# Altium project distance_sensor.PrjPcb
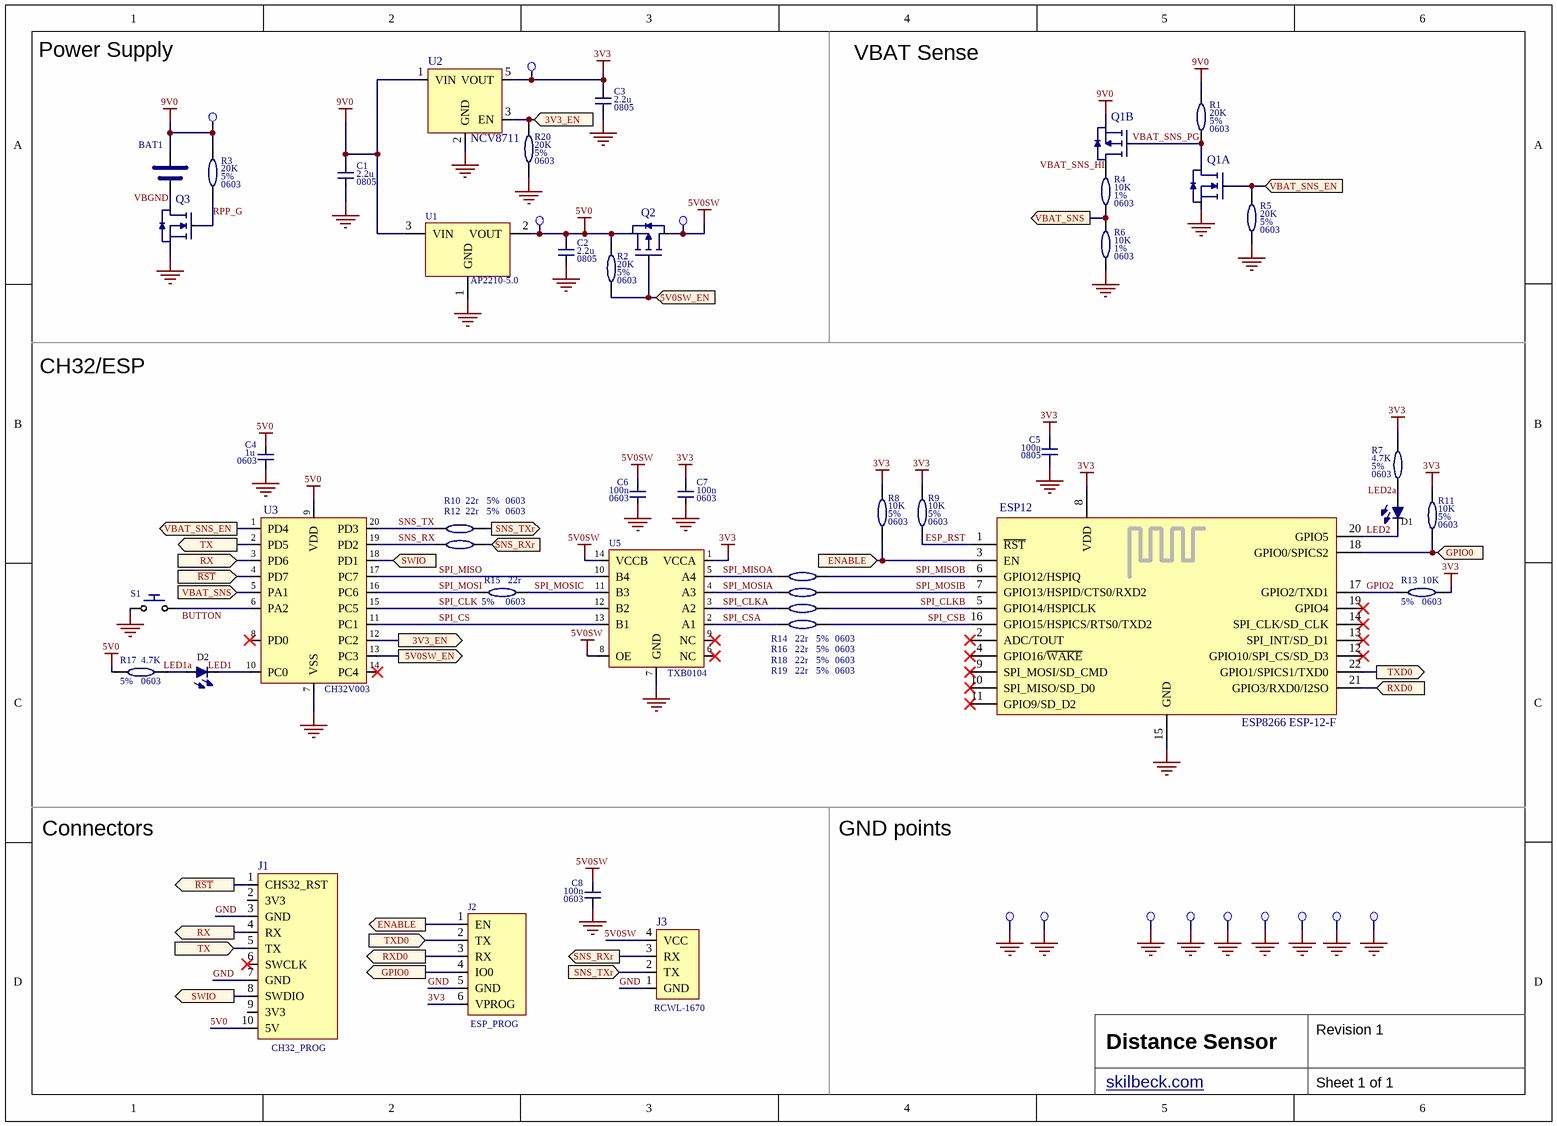
[diagram p0: distance_sensor.SchDoc]
1 sheet, 56 parts. Net scope: flat (ports and power ports of the same name join across sheets).
Board file: distance_sensor.PcbDoc

## Sheet distance_sensor.SchDoc: Distance Sensor
size 290 x 209 mm; Author: skilbeck.com; Revision: 1; SheetNumber: 1; SheetTotal: 1

### Parts
1  TESTPOINT  [TESTPOINT]  (value not drawn)  (no BOM)
2  TESTPOINT  [TESTPOINT]  (value not drawn)  (no BOM)
3  TESTPOINT  [TESTPOINT]  (value not drawn)  (no BOM)
4  TESTPOINT  [TESTPOINT]  (value not drawn)  (no BOM)
BAT1  BATTERY  [2X0.1HEADER]  (value not drawn)  (no BOM)
C1  2.2u  Package: 0805  [CAP 0805_2012]
C2  2.2u  Package: 0805  [CAP 0805_2012]
C3  2.2u  Package: 0805  [CAP 0805_2012]
C4  1u  Package: 0603  [CAP 0603_1608]
C5  100n  Package: 0805  [CAP 0805_2012]
C6  100n  Package: 0603  [CAP 0603_1608]
C7  100n  Package: 0603  [CAP 0603_1608]
C8  100n  Package: 0603  [CAP 0603_1608]
D1  *  [SMT_LED 0603_RED]  (value not drawn)
D2  *  [SMT_LED 0603_RED]  (value not drawn)
ESP12  ESP8266 ESP-12-F  [ESP8266 ESP-12-E]
GND1  TESTPOINT  [TESTPAD]  (value not drawn)  (no BOM)
GND2  TESTPOINT  [TESTPAD]  (value not drawn)  (no BOM)
GND5  TESTPOINT  [TESTPAD]  (value not drawn)  (no BOM)
GND6  TESTPOINT  [TESTPAD]  (value not drawn)  (no BOM)
GND7  TESTPOINT  [TESTPOINT]  (value not drawn)  (no BOM)
GND8  TESTPOINT  [TESTPAD]  (value not drawn)  (no BOM)
GND9  TESTPOINT  [TESTPAD]  (value not drawn)  (no BOM)
GND10  TESTPOINT  [TESTPAD]  (value not drawn)  (no BOM)
GND11  TESTPOINT  [TESTPAD]  (value not drawn)  (no BOM)
J1  CH32_PROG  [CH32_PROG]  (no BOM)
J2  ESP_PROG  [ESP_PROG]  (no BOM)
J3  RCWL-1670  [JST_PH_4WAY]
Q1  MOSFET-NP  [DMG6601LVT]  (value not drawn)  (parts A,B of 2)
Q2  MOSFET-P  [SOT95P230X110-3L]  (value not drawn)
Q3  MOSFET-N  [SOT95P230X110-3L]  (value not drawn)
R1  20K  Tolerance: 5%  Package: 0603  [RES 0603_1608]
R2  20K  Tolerance: 5%  Package: 0603  [RES 0603_1608]
R3  20K  Tolerance: 5%  Package: 0603  [RES 0603_1608]
R4  10K  Tolerance: 1%  Package: 0603  [RES 0603_1608]
R5  20K  Tolerance: 5%  Package: 0603  [RES 0603_1608]
R6  10K  Tolerance: 1%  Package: 0603  [RES 0603_1608]
R7  4.7K  Tolerance: 5%  Package: 0603  [RES 0603_1608]
R8  10K  Tolerance: 5%  Package: 0603  [RES 0603_1608]
R9  10K  Tolerance: 5%  Package: 0603  [RES 0603_1608]
R10  22r  Tolerance: 5%  Package: 0603  [RES 0603_1608]
R11  10K  Tolerance: 5%  Package: 0603  [RES 0603_1608]
R12  22r  Tolerance: 5%  Package: 0603  [RES 0603_1608]
R13  10K  Tolerance: 5%  Package: 0603  [RES 0603_1608]
R14  22r  Tolerance: 5%  Package: 0603  [RES 0603_1608]
R15  22r  Tolerance: 5%  Package: 0603  [RES 0603_1608]
R16  22r  Tolerance: 5%  Package: 0603  [RES 0603_1608]
R17  4.7K  Tolerance: 5%  Package: 0603  [RES 0603_1608]
R18  22r  Tolerance: 5%  Package: 0603  [RES 0603_1608]
R19  22r  Tolerance: 5%  Package: 0603  [RES 0603_1608]
R20  20K  Tolerance: 5%  Package: 0603  [RES 0603_1608]
S1  4-1437565-1  [FSM-SWITCH]  (value not drawn)
U1  AP2210-5.0  [SOT95P230X110-3L]
U2  NCV8711  [SOT23-5]
U3  CH32V003  [TSOP20-127P600-8N]
U5  TXB0104  [TSOP14-127P600-8N]

### Ports
3V3_EN (in), 3V3_EN (out), 5V0SW_EN (in), 5V0SW_EN (out), ENABLE (in), ENABLE (out), GPIO0 (in), GPIO0 (out), RX (in), RX (out), RXD0 (in), RXD0 (out), SNS_RXr (in), SNS_RXr (out), SNS_TXr (in), SNS_TXr (out), SWIO (in), SWIO (out), TX (in), TX (out), TXD0 (in), TXD0 (out), VBAT_SNS (in), VBAT_SNS (out), VBAT_SNS_EN (in), VBAT_SNS_EN (out), ~{RST} (in), ~{RST} (out)

### Nets
3V3: 4.1(TP) C3.2(B) C5.2(B) C7.2(B) ESP12.8(VDD) J2.6(VPROG) R7.1(A) R8.2(B) R9.2(B) R11.1(A) R13.1(A) U2.5(VOUT) U5.1(VCCA)
5V0: 2.1(TP) C2.2(B) C4.2(B) J1.10(5V) Q2.2(S) R2.2(B) R17.1(A) U1.2(VOUT) U3.9(VDD)
5V0SW: 3.1(TP) C6.2(B) C8.2(B) J3.4(VCC) Q2.3(D) U5.8(OE) U5.14(VCCB)
9V0: 1.1(TP) BAT1.VPOS(+) C1.2(B) Q1.S2(S) R1.2(B) R3.2(B) U1.3(VIN) U2.1(VIN)
GND: C1.1(A) C2.1(A) C3.1(A) C4.1(A) C5.1(A) C6.1(A) C7.1(A) C8.1(A) ESP12.15(GND) GND1.1(TP) GND2.1(TP) GND5.1(TP) GND6.1(TP) GND7.1(TP) GND8.1(TP) GND9.1(TP) GND10.1(TP) GND11.1(TP) J1.3(GND) J1.7(GND) J2.5(GND) J3.1(GND) Q1.S1(S) Q3.2(S) R5.1(A) R6.1(A) R20.1(A) S1.1 U1.1(GND) U2.2(GND) U3.7(VSS) U5.7(GND)
3V3_EN: R20.2(B) U2.3(EN) U3.12(PC2) ; port 3V3_EN
5V0SW_EN: Q2.1(G) R2.1(A) U3.13(PC3) ; port 5V0SW_EN
~{RST}: J1.1(CHS32_RST) U3.4(PD7) ; port ~{RST}
BUTTON: S1.2 U3.6(PA2)
ENABLE: ESP12.3(EN) J2.1(EN) R8.1(A) ; port ENABLE
ESP_RST: ESP12.1(~{RST}) R9.1(A)
GPIO0: ESP12.18(GPIO0/SPICS2) J2.4(IO0) R11.2(B) ; port GPIO0
GPIO2: ESP12.17(GPIO2/TXD1) R13.2(B)
LED1: D2.1(CATHODE) U3.10(PC0)
LED1a: D2.2(ANODE) R17.2(B)
LED2: D1.1(CATHODE) ESP12.20(GPIO5)
LED2a: D1.2(ANODE) R7.2(B)
RPP_G: Q3.1(G) R3.1(A)
RX: J1.4(RX) U3.3(PD6) ; port RX
RXD0: ESP12.21(GPIO3/RXD0/I2SO) J2.3(RX) ; port RXD0
SNS_RX: R12.1(A) U3.19(PD2)
SNS_RXr: J3.3(RX) R12.2(B) ; port SNS_RXr
SNS_TX: R10.1(A) U3.20(PD3)
SNS_TXr: J3.2(TX) R10.2(B) ; port SNS_TXr
SPI_CLK: U3.15(PC5) U5.12(B2)
SPI_CLKA: R18.1(A) U5.3(A2)
SPI_CLKB: ESP12.5(GPIO14/HSPICLK) R18.2(B)
SPI_CS: U3.11(PC1) U5.13(B1)
SPI_CSA: R19.1(A) U5.2(A1)
SPI_CSB: ESP12.16(GPIO15/HSPICS/RTS0/TXD2) R19.2(B)
SPI_MISO: U3.17(PC7) U5.10(B4)
SPI_MISOA: R14.1(A) U5.5(A4)
SPI_MISOB: ESP12.6(GPIO12/HSPIQ) R14.2(B)
SPI_MOSI: R15.1(A) U3.16(PC6)
SPI_MOSIA: R16.1(A) U5.4(A3)
SPI_MOSIB: ESP12.7(GPIO13/HSPID/CTS0/RXD2) R16.2(B)
SPI_MOSIC: R15.2(B) U5.11(B3)
SWIO: J1.8(SWDIO) U3.18(PD1) ; port SWIO
TX: J1.5(TX) U3.2(PD5) ; port TX
TXD0: ESP12.22(GPIO1/SPICS1/TXD0) J2.2(TX) ; port TXD0
VBAT_SNS: R4.1(A) R6.2(B) U3.5(PA1) ; port VBAT_SNS
VBAT_SNS_EN: Q1.G1(G) R5.2(B) U3.1(PD4) ; port VBAT_SNS_EN
VBAT_SNS_HI: Q1.D2(D) R4.2(B)
VBAT_SNS_PG: Q1.D1(D) Q1.G2(G) R1.1(A)
VBGND: BAT1.VNEG(-) Q3.3(D)

Not connected (* = marked no-connect by the designer): ESP12 2(ADC/TOUT)* 4(GPIO16/~{WAKE})* 9(SPI_MOSI/SD_CMD)* 10(SPI_MISO/SD_D0)* 11(GPIO9/SD_D2)* 12(GPIO10/SPI_CS/SD_D3)* 13(SPI_INT/SD_D1)* 14(SPI_CLK/SD_CLK)* 19(GPIO4)*; J1 2(3V3) 6(SWCLK)* 9(3V3); U3 8(PD0)* 14(PC4)*; U5 6(NC)* 9(NC)*

### Notes on the sheet
- Power Supply
- VBAT Sense
- CH32/ESP
- Connectors
- GND points

### Library data of the parts
1 = TESTPOINT: TestID: 9V0
2 = TESTPOINT: TestID: 5V0
3 = TESTPOINT: TestID: 5VS
4 = TESTPOINT: TestID: 3V3
C1-C8 = CAP_CERAMIC: MLCC; LCSC Part Number: *; Dielectric: *
  C1-C3: Value: 2.2u
  C4: Value: 1u
  C5-C8: Value: 100n
D1 D2 = LED: Value: *; LCSC Part Number: *
GND1 GND2 GND5-GND11 = TESTPOINT: TestID: GND
Q1 = MOSFET-NP: N/P Channel MOSFET; pin to pad: D1>6 D2>4 G1>1 G2>3 S1>5 S2>2; Manufacturer Part Number: DMC2400UV-13; LCSC Part Number: C500791
Q2 = MOSFET-P: P Channel MOSFET. 300mA; Manufacturer Part Number: DMP3099L-13; LCSC Part Number: C412516
Q3 = MOSFET-N: N Channel MOSFET. 300mA
R1-R20 = RESISTOR: Power: 125mW; LCSC Part Number: *
  R1-R3 R5 R20: Value: 20K
  R4 R6 R8 R9 R11 R13: Value: 10K
  R7 R17: Value: 4.7K
  R10 R12 R14-R16 R18 R19: Value: 22r
S1 = BUTTON: 6x6mm SMD tactile switch,SPST-NO; Manufacturer_Name: TE Connectivity; Allied_Number: R1117787; RS Part Number: 1616046; Manufacturer_Part_Number: 4-1437565-1; Datasheet Link: http://uk.rs-online.com/web/p/products/1616046
U1 = LDO_5V: 5v LDO, 100mA; Manufacturer Part Number: *; LCSC Part Number: *
U2 = NCV8711: 3.3v LDO; Manufacturer Part Number: MC33375ST−3.3T3G
U3 = CH32V003: MCU
U5 = TXB0104: Level shifter